# Altium schematic sheet Debug_USB.SchDoc: FIoT Rev 2.0
size A4; ApprovedBy: PM; CheckedBy: PM; Author: AG; CompanyName: -; DrawnBy: AG; Engineer: AG; DocumentNumber: 18072022 - 1; Revision: 0; SheetNumber: 4; SheetTotal: 8; ENG_APP_DATE: --/--/--; DSN_APP_DATE: --/--/--; CHK_APP_DATE: --/--/--
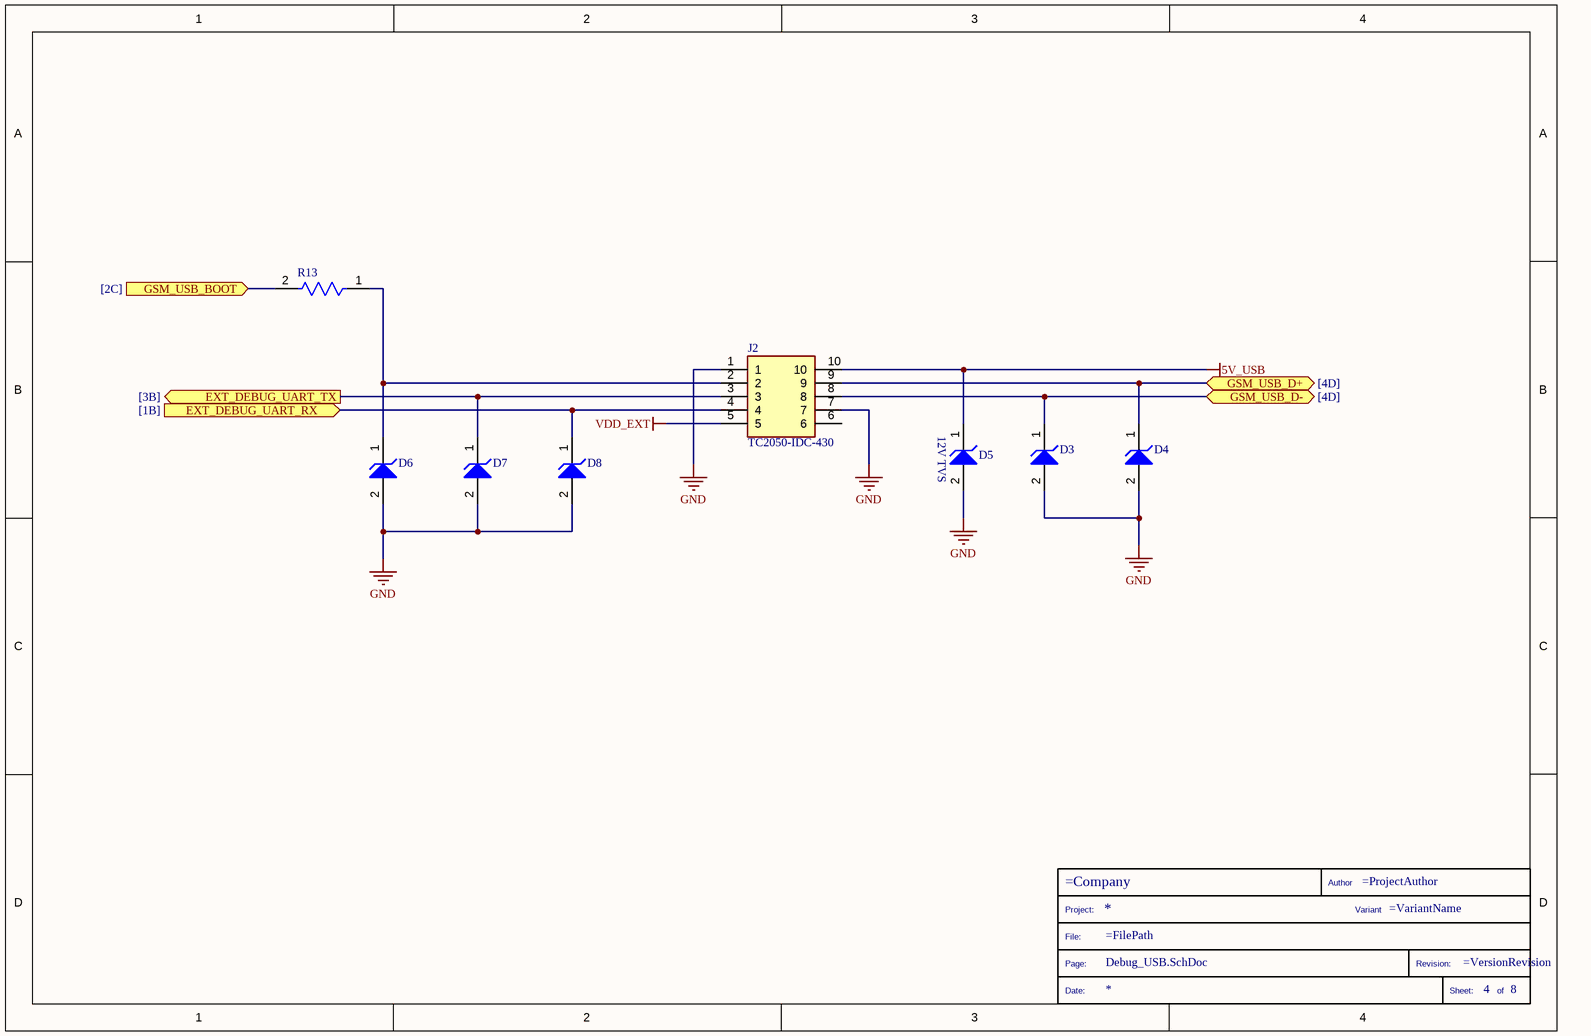
[diagram p0: Debug_USB.SchDoc]

## Parts
*?  TitleBlock  (value not drawn)  (graphical)
D3  ESD9L5.0ST5G  [ONSC-SOD-923-2-514AA-01_V]  (value not drawn)
D4  ESD9L5.0ST5G  [ONSC-SOD-923-2-514AA-01_V]  (value not drawn)
D5  SD12C.TCT  [CR_SD05_SEM-L]  (value not drawn)
D6  ESD9X3.3ST5G  [ONSC-SOD-923-2-514AA-01_V]  (value not drawn)
D7  ESD9X3.3ST5G  [ONSC-SOD-923-2-514AA-01_V]  (value not drawn)
D8  ESD9X3.3ST5G  [ONSC-SOD-923-2-514AA-01_V]  (value not drawn)
J2  TC2050-IDC-430  [TC2050-IDC_Lumen]  (no BOM)
R13  0402WGF1002TCE  [FP-CRCW0402-e3-MFG]  (value not drawn)

## Ports
EXT_DEBUG_UART_RX (in, see [1B]), EXT_DEBUG_UART_TX (out, see [3B]), GSM_USB_BOOT (in, see [2C]), GSM_USB_D+ (bidir, see [4D]), GSM_USB_D- (bidir, see [4D])

## Nets
5V_USB: D5.1(K) J2.10
GND: D3.2(A) D4.2(A) D5.2(A) D6.2(A) D7.2(A) D8.2(A) J2.1 J2.7
VDD_EXT: J2.5
EXT_DEBUG_UART_RX: D8.1(K) J2.4 ; port EXT_DEBUG_UART_RX
EXT_DEBUG_UART_TX: D7.1(K) J2.3 ; port EXT_DEBUG_UART_TX
GSM_USB_BOOT: R13.2 ; port GSM_USB_BOOT
GSM_USB_D+: D4.1(K) J2.9 ; port GSM_USB_D+
GSM_USB_D-: D3.1(K) J2.8 ; port GSM_USB_D-
NetD6_1: D6.1(K) J2.2 R13.1

Not connected (* = marked no-connect by the designer): J2 6

## Notes on the sheet
- DWG. NO.
- REV.
- SHT.
- THIS DOCUMENT AND THE DATA DISCLOSED HEREIN OR HEREWITH IS THE PROPERTY OF ALTIUM LIMITED AND MAY BE FREELY DISTRIBUTED IN WHOLE. NO RIGHTS ARE RESERVED OR EXPRESS OR IMPLIED WARANTEE GIVEN.
- REVISION
- DESCRIPTION
- DATE
- APPROVED
- ENG:
- APPROVALS
- PROJECT
- DSN:
- CHK:
- REFERENCE DOCUMENTS
- PROJECT REVISION:
- TITLE
- DOCUMENT REVISION:
- DESIGN ITEM:
- BOM:
- FAB DWG:
- PCB DWG:
- ASSY DWG:
- SCALE:
- SIZE
- B
- CAGE CODE
- FILE NAME
- DWG NO.
- SHEET
- OF
- REV
- (in symbol LPN00017) 12V TVS
- (in symbol TitleBlock) Author; Project:; Variant; File:; Page:; Revision:; Date:; Sheet:; of

## Library data of the parts
D3 D4 = LPN00012: Transient Voltage Suppressor, ESD Protection Diode with Ultra-Low Capacitance, 2-Pin SOD-923, Pb-Free, Tape and Reel; Manufacturer 1: ON Semiconductor; Manufacturer Part Number 1: ESD9L5.0ST5G; Supplier 1: Digi-Key; Supplier Part Number 1: ESD9L5.0ST5GOSCT-ND; Lumen Part Number: LPN00012
D5 = LPN00017: TVS DIODE 12VWM 24VC SOD323; Supplier 1: Digi-Key; Supplier Part Number 1: SD12C.TCTCT-ND; Lumen Part Number: LPN00017
D6-D8 = LPN00013: Transient Voltage Suppressor, Micro-Packaged Diode for ESD Protection, 2-Pin SOD-923, Pb-Free, Tape and Reel; Manufacturer 1: On Semiconductor; Manufacturer Part Number 1: ESD9X3.3ST5G; Supplier 1: Farnell; Supplier Part Number 1: 2627963; Lumen Part Number: LPN00013
J2 = LPN00019: Connector; Lumen Part Number: LPN00019
R13 = LPN0003: Res Thick Film 0402 10K Ohm 1% 0.063W; Manufacturer 1: Vishay Dale; Manufacturer Part Number 1: CRCW04021K00FKED; Supplier 1: Mouser; Supplier Part Number 1: 303-0402WGF1002TCE; Lumen Part Number: LPN0003